# Altium schematic sheet ethernet.SchDoc: Ethernet Section
size B; DrawnBy: Adam Vadala-Roth; DocumentNumber: 5; Revision: 2.4b; SheetNumber: 5; SheetTotal: 9
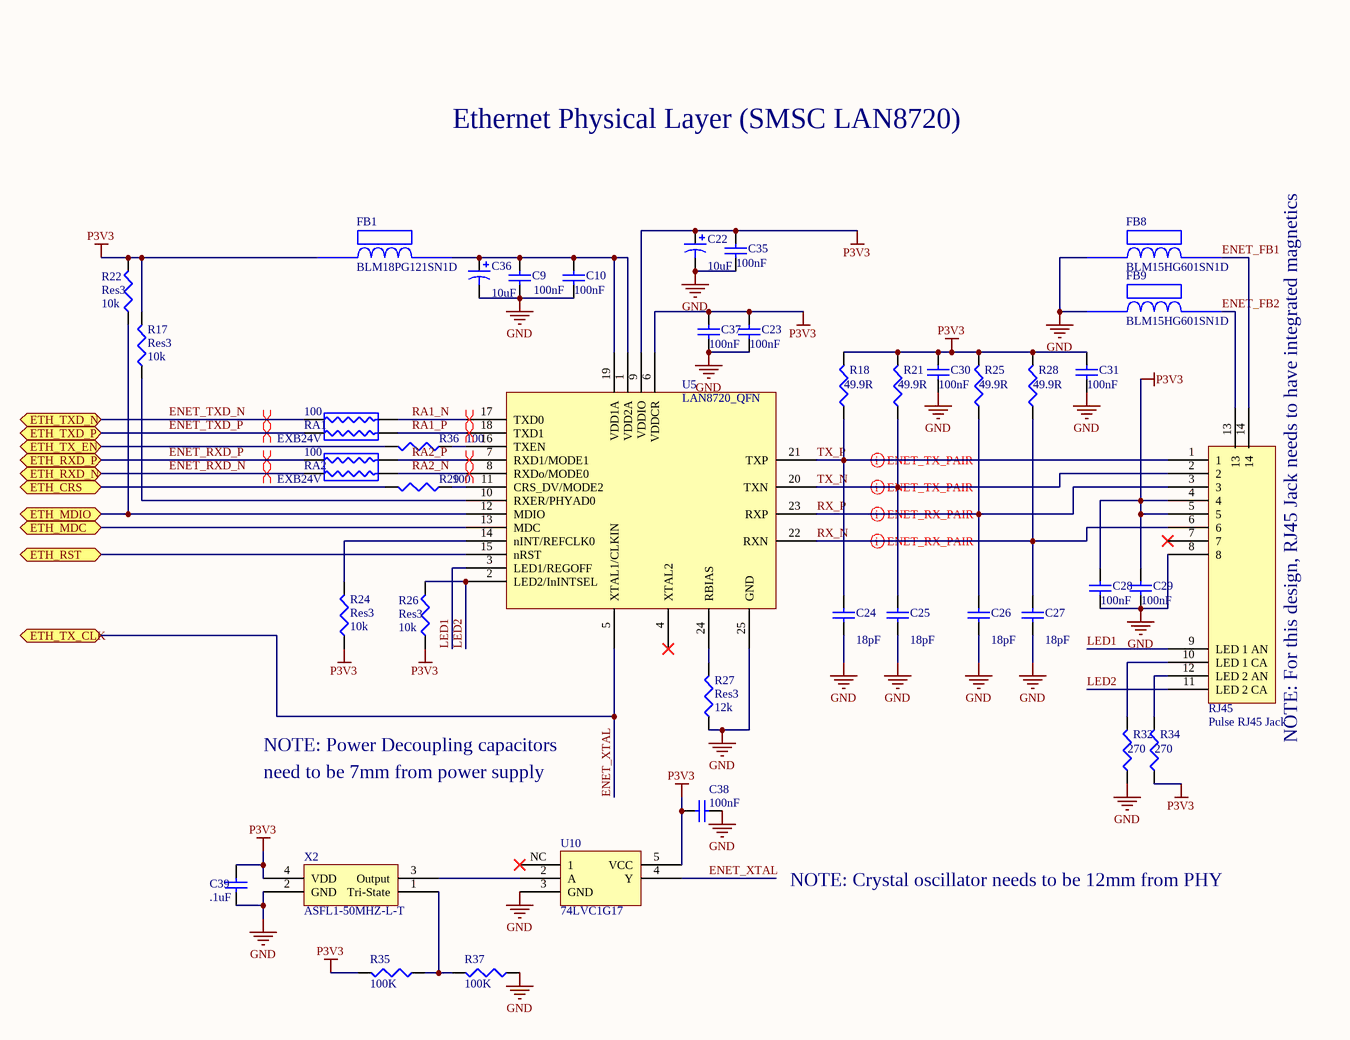
[diagram p0: ethernet.SchDoc]

## Parts
C9  value 100nF  [1608[0603]]  (hidden comment: Cap Semi)
C10  value 100nF  [1608[0603]]  (hidden comment: Cap Semi)
C22  value 10uF  [CAPC1005X55N]  (hidden comment: Cap Pol3)
C23  value 100nF  [1608[0603]]  (hidden comment: Cap Semi)
C24  value 18pF  [1608[0603]]  (hidden comment: Cap Semi)
C25  value 18pF  [1608[0603]]  (hidden comment: Cap Semi)
C26  value 18pF  [1608[0603]]  (hidden comment: Cap Semi)
C27  value 18pF  [1608[0603]]  (hidden comment: Cap Semi)
C28  value 100nF  [1608[0603]]  (hidden comment: Cap Semi)
C29  value 100nF  [1608[0603]]  (hidden comment: Cap Semi)
C30  value 100nF  [1608[0603]]  (hidden comment: Cap Semi)
C31  value 100nF  [1608[0603]]  (hidden comment: Cap Semi)
C35  value 100nF  [1608[0603]]  (hidden comment: Cap Semi)
C36  value 10uF  [1608[0603]]  (hidden comment: Cap Pol3)
C37  value 100nF  [1608[0603]]  (hidden comment: Cap Semi)
C38  value 100nF  [1608[0603]]  (hidden comment: Cap Semi)
C39  value .1uF  [1608[0603]]  (hidden comment: Cap Semi)
FB1  BLM18PG121SN1D  [BLM18PG121SN1D]
FB8  BLM15HG601SN1D  [BLM18PG121SN1D]
FB9  BLM15HG601SN1D  [BLM18PG121SN1D]
R17  Res3  value 10k  [J1-0603]
R18  value 49.9R  [J1-0603]  (hidden comment: Res3)
R21  value 49.9R  [J1-0603]  (hidden comment: Res3)
R22  Res3  value 10k  [J1-0603]
R24  Res3  value 10k  [J1-0603]
R25  value 49.9R  [J1-0603]  (hidden comment: Res3)
R26  Res3  value 10k  [J1-0603]
R27  Res3  value 12k  [J1-0603]
R28  value 49.9R  [J1-0603]  (hidden comment: Res3)
R29  value 100  [J1-0603]  (hidden comment: Res3)
R32  value 270  [J1-0603]  (hidden comment: Res3)
R34  value 270  [J1-0603]  (hidden comment: Res3)
R35  value 100K  [J1-0603]  (hidden comment: Res3)
R36  value 100  [J1-0603]  (hidden comment: Res3)
R37  value 100K  [J1-0603]  (hidden comment: Res3)
RA1  EXB24V  value 100  [EXB24V - Res Array x2]
RA2  EXB24V  value 100  [EXB24V - Res Array x2]
RJ45  Pulse RJ45 Jack  [J0006D21BNL]
U5  LAN8720_QFN  [LAN8720_QFN]
U10  74LVC1G17  [74LVC1G17]
X2  ASFL1-50MHZ-L-T  [ASFL1-50MHZ-L-T]

## Ports
ETH_CRS, ETH_MDC, ETH_MDIO, ETH_RST, ETH_RXD_N, ETH_RXD_P, ETH_TX_CLK, ETH_TX_EN, ETH_TXD_N, ETH_TXD_P

## Nets
GND: C9.1 C10.1 C22.2 C23.1 C24.1 C25.1 C26.1 C27.1 C28.1 C29.1 C30.1 C31.1 C35.1 C36.2 C37.1 C38.1 C39.1 FB8.1 FB9.1 R27.1 R32.1 R37.1 RJ45.8 U5.25(GND) U10.3(GND) X2.2(GND)
P3V3: C22.1 C23.2 C28.2 C29.2 C30.2 C31.2 C35.2 C37.2 C38.2 C39.2 FB1.1 R17.2 R18.2 R21.2 R22.2 R24.1 R25.2 R26.1 R28.2 R34.1 R35.2 RJ45.4 RJ45.5 U5.6(VDDCR) U5.9(VDDIO) U10.5(VCC) X2.4(VDD)
ENET_FB1: FB8.2 RJ45.14
ENET_FB2: FB9.2 RJ45.13
ENET_RXD_N: RA2.1 ; port ETH_RXD_N
ENET_RXD_P: RA2.3 ; port ETH_RXD_P
ENET_TXD_N: RA1.3 ; port ETH_TXD_N
ENET_TXD_P: RA1.1 ; port ETH_TXD_P
ENET_XTAL: U5.5(XTAL1/CLKIN) U10.4(Y) ; port ETH_TX_CLK
ETH_CRS: R29.2 ; port ETH_CRS
ETH_MDC: U5.13(MDC) ; port ETH_MDC
ETH_MDIO: R22.1 U5.12(MDIO) ; port ETH_MDIO
ETH_RST: U5.15(nRST) ; port ETH_RST
ETH_TX_EN: R36.2 ; port ETH_TX_EN
LED1: RJ45.9(LED_1_AN) U5.3(LED1/REGOFF)
LED2: R26.2 RJ45.11(LED_2_CA) U5.2(LED2/InINTSEL)
RA1_N: RA1.4 U5.17(TXD0)
RA1_P: RA1.2 U5.18(TXD1)
RA2_N: RA2.2 U5.8(RXDo/MODE0)
RA2_P: RA2.4 U5.7(RXD1/MODE1)
RX_N: C27.2 R28.1 RJ45.6 U5.22(RXN)
RX_P: C26.2 R25.1 RJ45.3 U5.23(RXP)
TX_N: C25.2 R21.1 RJ45.2 U5.20(TXN)
TX_P: C24.2 R18.1 RJ45.1 U5.21(TXP)
NetC9_2: C9.2 C10.2 C36.1 FB1.2 U5.1(VDD2A) U5.19(VDD1A)
NetR17_1: R17.1 U5.10(RXER/PHYAD0)
NetR24_2: R24.2 U5.14(nINT/REFCLK0)
NetR27_2: R27.2 U5.24(RBIAS)
NetR29_1: R29.1 U5.11(CRS_DV/MODE2)
NetR32_2: R32.2 RJ45.10(LED_1_CA)
NetR34_2: R34.2 RJ45.12(LED_2_AN)
NetR35_1: R35.1 R37.2 X2.1(Tri-State)
NetR36_1: R36.1 U5.16(TXEN)
NetU10_2: U10.2(A) X2.3(Output)

Not connected (* = marked no-connect by the designer): RJ45 7*; U5 4(XTAL2)*; U10 NC(1)*

## Layout directives
differential pair: ENET_RXD_N, ENET_RXD_P, ENET_TXD_N, ENET_TXD_P, RA1_N, RA1_P, RA2_N, RA2_P, RX_N, RX_P, TX_N, TX_P

## Notes on the sheet
- Ethernet Physical Layer (SMSC LAN8720)
- (near RJ45) NOTE: For this design, RJ45 Jack needs to have integrated magnetics
- NOTE: Power Decoupling capacitors
- need to be 7mm from power supply
- NOTE: Crystal oscillator needs to be 12mm from PHY

## Library data of the parts
C9 C10 C23-C31 C35 C37-C39 = Cap Semi: Capacitor (Semiconductor SIM Model); Published: 8-Jun-2000; LatestRevisionDate: 29-May-2009; LatestRevisionNote: IPC-7351 Footprint Added.; PackageReference: C1206; Publisher: Altium Limited; PackageDescription: Chip Capacitor
C22 C36 = Cap Pol3: Polarized Capacitor (Surface Mount); Published: 8-Jun-2000; LatestRevisionDate: 29-May-2009; LatestRevisionNote: IPC-7351 Footprint Added.; PackageReference: C0805; Publisher: Altium Limited; PackageDescription: Chip Capacitor
R17 R18 R21 R22 R24-R29 R32 R34-R37 = Res3: Resistor; Published: 8-Jun-2000; LatestRevisionDate: 29-May-2009; LatestRevisionNote: IPC-7351 Footprint Added.; PackageReference: J1-0603; Publisher: Altium Limited; PackageDescription: Chip Resistor
RA1 RA2 = EXB24V - Res Array x2
RJ45 = Pulse RJ45_ICM_LED_Jack
U5 = LAN8720 QFN